# Altium schematic sheet Master Schematic.SchDoc
size A2; SheetNumber: 2; SheetTotal: 2
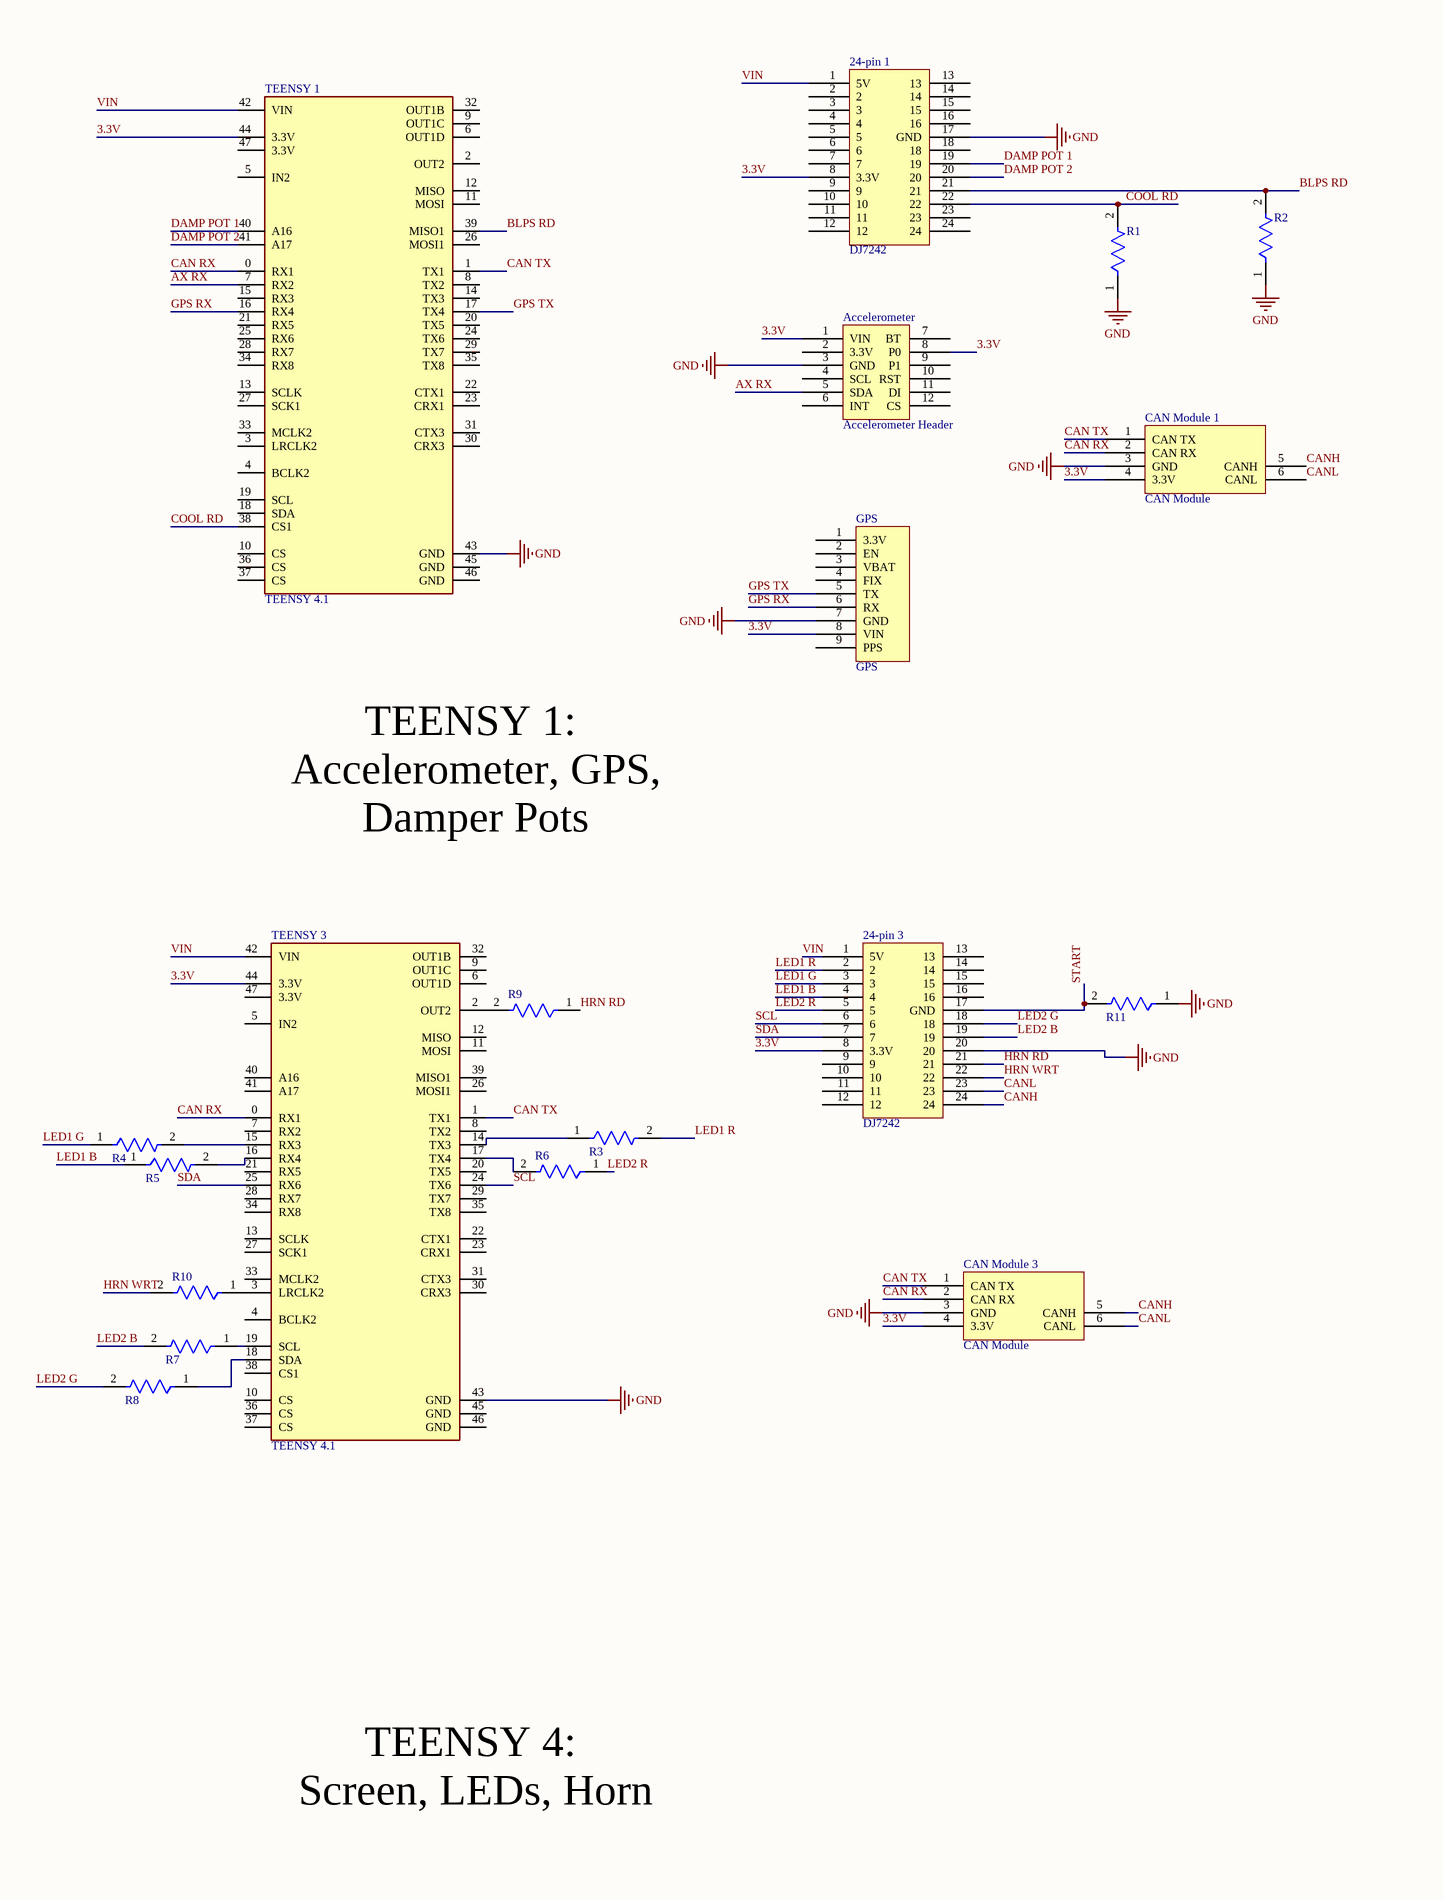
[diagram p0: Master Schematic.SchDoc, left]
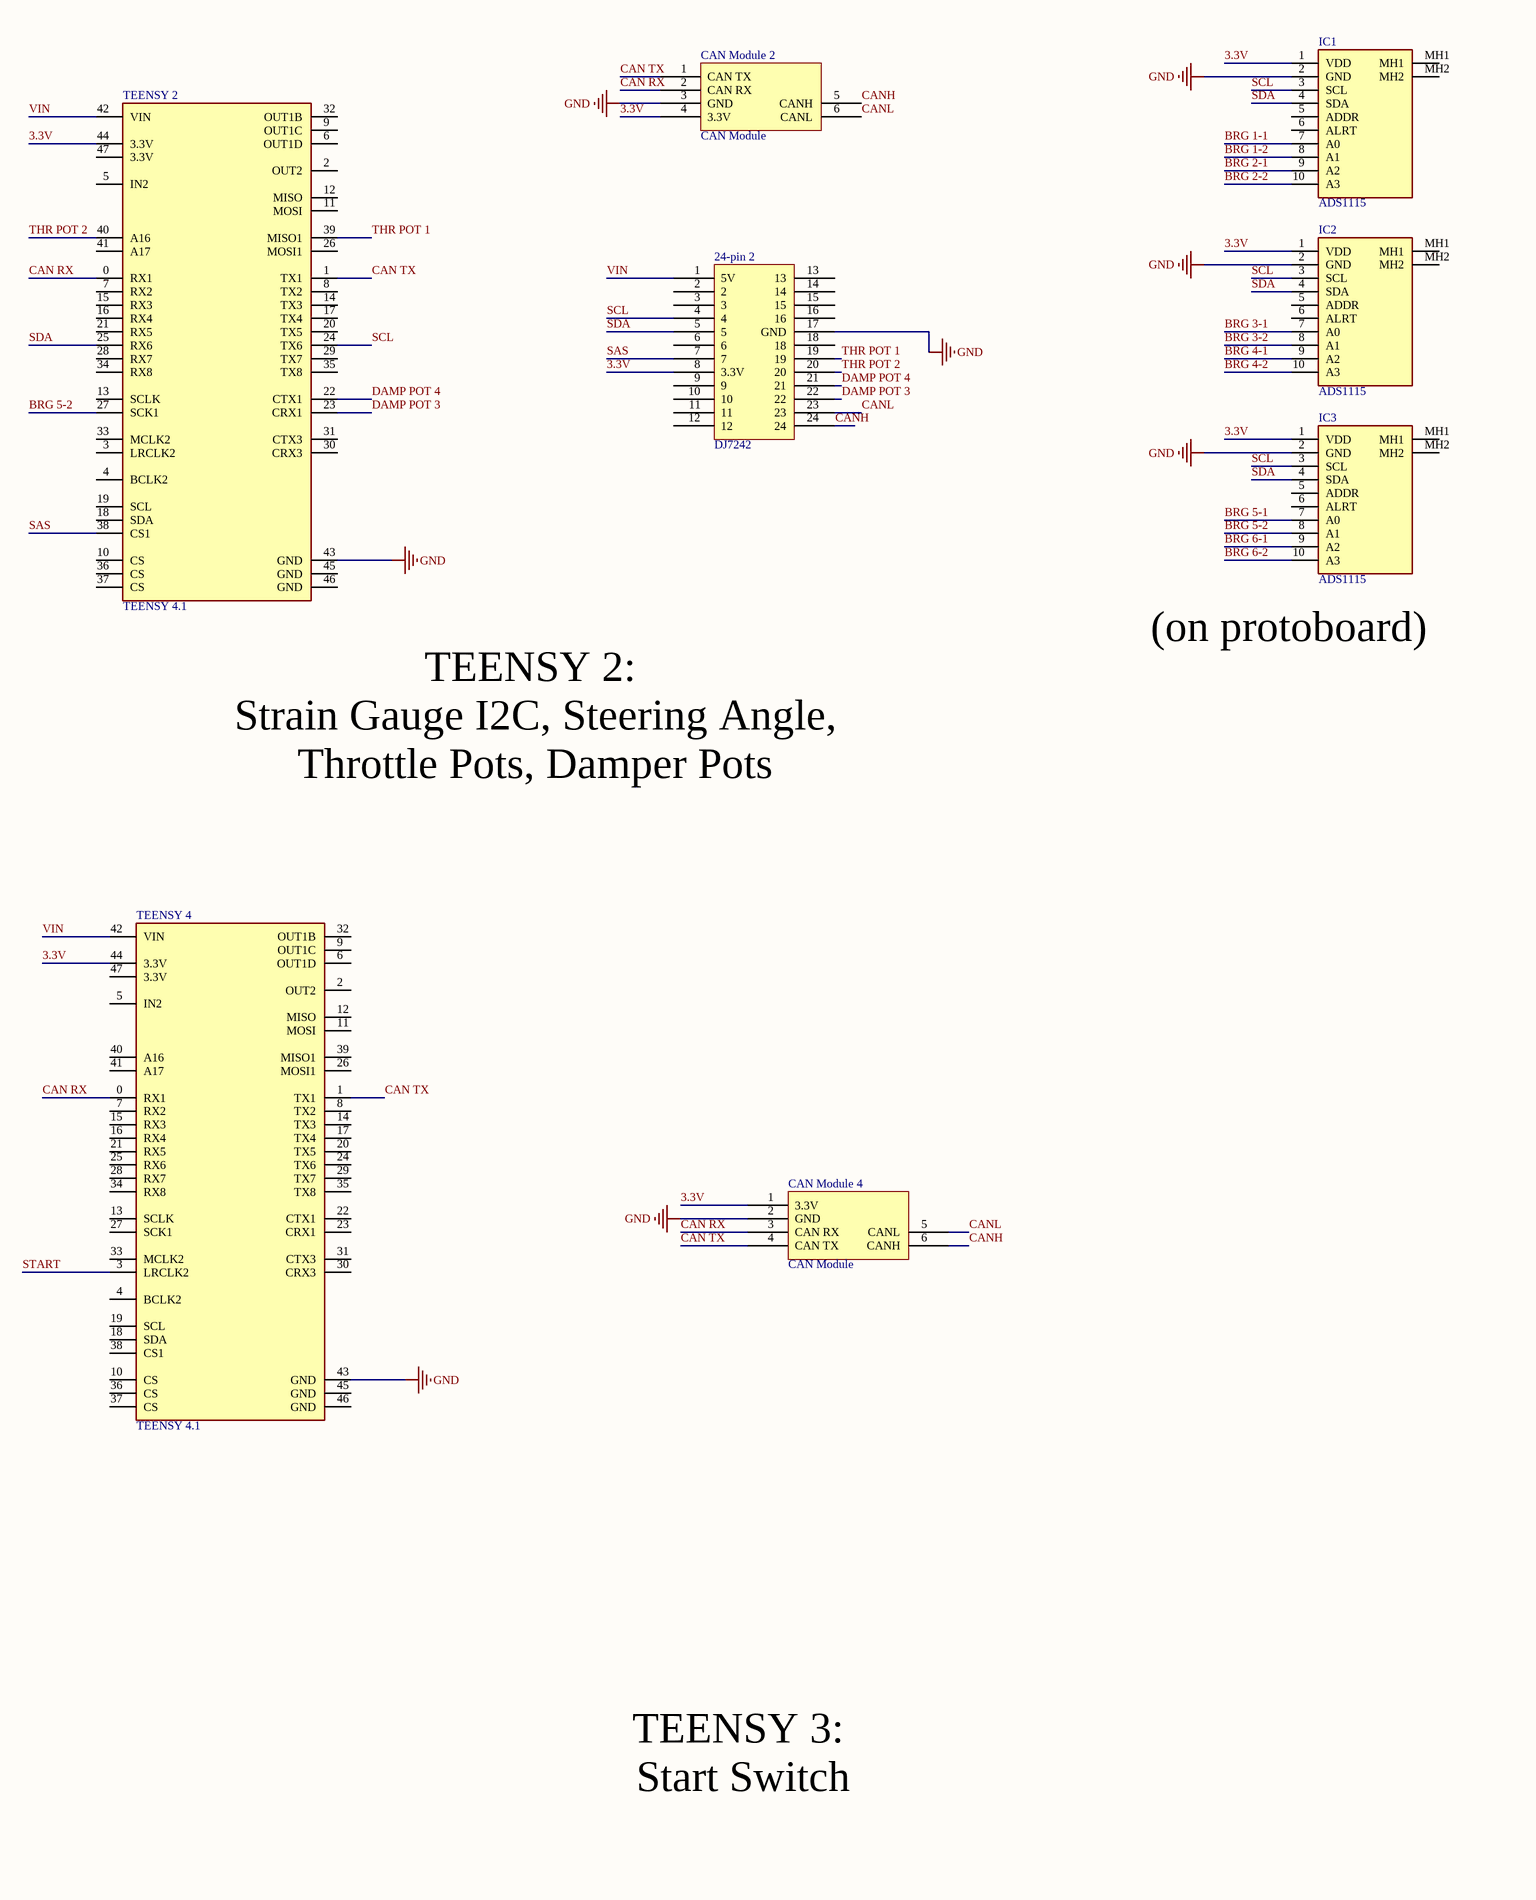
[diagram p1: Master Schematic.SchDoc, right]

## Parts
24-pin_1  DJ7242  [DJ7242-Footprint-1]
24-pin_2  DJ7242  [DJ7242-Footprint-1]
24-pin_3  DJ7242  [DJ7242-Footprint-1]
Accelerometer  Accelerometer Header  [Accelerometer Header-Footprint-1]
CAN_Module_1  CAN Module  [CAN Module-Footprint-1]
CAN_Module_2  CAN Module  [CAN Module-Footprint-1]
CAN_Module_3  CAN Module  [CAN Module-Footprint-1]
CAN_Module_4  CAN Module  [CAN Module-Footprint-1]
GPS  GPS  [GPS-Footprint-1]
IC1  ADS1115  [ADS1115]
IC2  ADS1115  [ADS1115]
IC3  ADS1115  [ADS1115]
R1  CMF5073K200FHEB  [FP-CMF50-0]  (value not drawn)
R2  CMF5073K200FHEB  [FP-CMF50-0]  (value not drawn)
R3  CMF5073K200FHEB  [FP-CMF50-0]  (value not drawn)
R4  CMF5073K200FHEB  [FP-CMF50-0]  (value not drawn)
R5  CMF5073K200FHEB  [FP-CMF50-0]  (value not drawn)
R6  CMF5073K200FHEB  [FP-CMF50-0]  (value not drawn)
R7  CMF5073K200FHEB  [FP-CMF50-0]  (value not drawn)
R8  CMF5073K200FHEB  [FP-CMF50-0]  (value not drawn)
R9  CMF5073K200FHEB  [FP-CMF50-0]  (value not drawn)
R10  CMF5073K200FHEB  [FP-CMF50-0]  (value not drawn)
R11  CMF5073K200FHEB  [FP-CMF50-0]  (value not drawn)
TEENSY_1  TEENSY 4.1  [FP-DEV-16996-MFG]
TEENSY_2  TEENSY 4.1  [FP-DEV-16996-MFG]
TEENSY_3  TEENSY 4.1  [FP-DEV-16996-MFG]
TEENSY_4  TEENSY 4.1  [FP-DEV-16996-MFG]

## Nets
GND: 24-pin_1.17(GND) 24-pin_2.17(GND) 24-pin_3.20 Accelerometer.3(GND) CAN_Module_1.3(GND) CAN_Module_2.3(GND) CAN_Module_3.3(GND) CAN_Module_4.2(GND) GPS.7(GND) IC1.2(GND) IC2.2(GND) IC3.2(GND) R1.1 R2.1 R11.1 TEENSY_1.43(GND) TEENSY_2.43(GND) TEENSY_3.43(GND) TEENSY_4.43(GND)
3.3V: 24-pin_1.8(3.3V) 24-pin_2.8(3.3V) 24-pin_3.8(3.3V) Accelerometer.1(VIN) Accelerometer.8(P0) CAN_Module_1.4(3.3V) CAN_Module_2.4(3.3V) CAN_Module_3.4(3.3V) CAN_Module_4.1(3.3V) GPS.8(VIN) IC1.1(VDD) IC2.1(VDD) IC3.1(VDD) TEENSY_1.44(3.3V) TEENSY_2.44(3.3V) TEENSY_3.44(3.3V) TEENSY_4.44(3.3V)
AX RX: Accelerometer.5(SDA) TEENSY_1.7(RX2)
BLPS RD: 24-pin_1.21 R2.2 TEENSY_1.39(MISO1)
BRG 1-1: IC1.7(A0)
BRG 1-2: IC1.8(A1)
BRG 2-1: IC1.9(A2)
BRG 2-2: IC1.10(A3)
BRG 3-1: IC2.7(A0)
BRG 3-2: IC2.8(A1)
BRG 4-1: IC2.9(A2)
BRG 4-2: IC2.10(A3)
BRG 5-1: IC3.7(A0)
BRG 5-2: IC3.8(A1) TEENSY_2.27(SCK1)
BRG 6-1: IC3.9(A2)
BRG 6-2: IC3.10(A3)
CAN RX: CAN_Module_1.2(CAN_RX) CAN_Module_2.2(CAN_RX) CAN_Module_3.2(CAN_RX) CAN_Module_4.3(CAN_RX) TEENSY_1.0(RX1) TEENSY_2.0(RX1) TEENSY_3.0(RX1) TEENSY_4.0(RX1)
CAN TX: CAN_Module_1.1(CAN_TX) CAN_Module_2.1(CAN_TX) CAN_Module_3.1(CAN_TX) CAN_Module_4.4(CAN_TX) TEENSY_1.1(TX1) TEENSY_2.1(TX1) TEENSY_3.1(TX1) TEENSY_4.1(TX1)
CANH: 24-pin_2.24 24-pin_3.24 CAN_Module_1.5(CANH) CAN_Module_2.5(CANH) CAN_Module_3.5(CANH) CAN_Module_4.6(CANH)
CANL: 24-pin_2.23 24-pin_3.23 CAN_Module_1.6(CANL) CAN_Module_2.6(CANL) CAN_Module_3.6(CANL) CAN_Module_4.5(CANL)
COOL RD: 24-pin_1.22 R1.2 TEENSY_1.38(CS1)
DAMP POT 1: 24-pin_1.19 TEENSY_1.40(A16)
DAMP POT 2: 24-pin_1.20 TEENSY_1.41(A17)
DAMP POT 3: 24-pin_2.22 TEENSY_2.23(CRX1)
DAMP POT 4: 24-pin_2.21 TEENSY_2.22(CTX1)
GPS RX: GPS.6(RX) TEENSY_1.16(RX4)
GPS TX: GPS.5(TX) TEENSY_1.17(TX4)
HRN RD: 24-pin_3.21 R9.1
HRN WRT: 24-pin_3.22 R10.2
LED1 B: 24-pin_3.4 R5.1
LED1 G: 24-pin_3.3 R4.1
LED1 R: 24-pin_3.2 R3.2
LED2 B: 24-pin_3.19 R7.2
LED2 G: 24-pin_3.18 R8.2
LED2 R: 24-pin_3.5 R6.1
SAS: 24-pin_2.7 TEENSY_2.38(CS1)
SCL: 24-pin_2.4 24-pin_3.6 IC1.3(SCL) IC2.3(SCL) IC3.3(SCL) TEENSY_2.24(TX6) TEENSY_3.24(TX6)
SDA: 24-pin_2.5 24-pin_3.7 IC1.4(SDA) IC2.4(SDA) IC3.4(SDA) TEENSY_2.25(RX6) TEENSY_3.25(RX6)
START: 24-pin_3.17(GND) R11.2 TEENSY_4.3(LRCLK2)
THR POT 1: 24-pin_2.19 TEENSY_2.39(MISO1)
THR POT 2: 24-pin_2.20 TEENSY_2.40(A16)
VIN: 24-pin_1.1(5V) 24-pin_2.1(5V) 24-pin_3.1(5V) TEENSY_1.42(VIN) TEENSY_2.42(VIN) TEENSY_3.42(VIN) TEENSY_4.42(VIN)
NetR3_1: R3.1 TEENSY_3.14(TX3)
NetR4_2: R4.2 TEENSY_3.15(RX3)
NetR5_2: R5.2 TEENSY_3.16(RX4)
NetR6_2: R6.2 TEENSY_3.17(TX4)
NetR7_1: R7.1 TEENSY_3.19(SCL)
NetR8_1: R8.1 TEENSY_3.18(SDA)
NetR9_2: R9.2 TEENSY_3.2(OUT2)
NetR10_1: R10.1 TEENSY_3.3(LRCLK2)

Not connected (* = marked no-connect by the designer): 24-pin_1 2 3 4 5 6 7 9 10 11 12 13 14 15 16 18 23 24; 24-pin_2 2 3 6 9 10 11 12 13 14 15 16 18; 24-pin_3 9 10 11 12 13 14 15 16; Accelerometer 2(3.3V) 4(SCL) 6(INT) 7(BT) 9(P1) 10(RST) 11(DI) 12(CS); GPS 1(3.3V) 2(EN) 3(VBAT) 4(FIX) 9(PPS); IC1 5(ADDR) 6(ALRT) MH1 MH2; IC2 5(ADDR) 6(ALRT) MH1 MH2; IC3 5(ADDR) 6(ALRT) MH1 MH2; TEENSY_1 2(OUT2) 3(LRCLK2) 4(BCLK2) 5(IN2) 6(OUT1D) 8(TX2) 9(OUT1C) 10(CS) 11(MOSI) 12(MISO) 13(SCLK) 14(TX3) 15(RX3) 18(SDA) 19(SCL) 20(TX5) 21(RX5) 22(CTX1) 23(CRX1) 24(TX6) 25(RX6) 26(MOSI1) 27(SCK1) 28(RX7) 29(TX7) 30(CRX3) 31(CTX3) 32(OUT1B) 33(MCLK2) 34(RX8) 35(TX8) 36(CS) 37(CS) 45(GND) 46(GND) 47(3.3V); TEENSY_2 2(OUT2) 3(LRCLK2) 4(BCLK2) 5(IN2) 6(OUT1D) 7(RX2) 8(TX2) 9(OUT1C) 10(CS) 11(MOSI) 12(MISO) 13(SCLK) 14(TX3) 15(RX3) 16(RX4) 17(TX4) 18(SDA) 19(SCL) 20(TX5) 21(RX5) 26(MOSI1) 28(RX7) 29(TX7) 30(CRX3) 31(CTX3) 32(OUT1B) 33(MCLK2) 34(RX8) 35(TX8) 36(CS) 37(CS) 41(A17) 45(GND) 46(GND) 47(3.3V); TEENSY_3 4(BCLK2) 5(IN2) 6(OUT1D) 7(RX2) 8(TX2) 9(OUT1C) 10(CS) 11(MOSI) 12(MISO) 13(SCLK) 20(TX5) 21(RX5) 22(CTX1) 23(CRX1) 26(MOSI1) 27(SCK1) 28(RX7) 29(TX7) 30(CRX3) 31(CTX3) 32(OUT1B) 33(MCLK2) 34(RX8) 35(TX8) 36(CS) 37(CS) 38(CS1) 39(MISO1) 40(A16) 41(A17) 45(GND) 46(GND) 47(3.3V); TEENSY_4 2(OUT2) 4(BCLK2) 5(IN2) 6(OUT1D) 7(RX2) 8(TX2) 9(OUT1C) 10(CS) 11(MOSI) 12(MISO) 13(SCLK) 14(TX3) 15(RX3) 16(RX4) 17(TX4) 18(SDA) 19(SCL) 20(TX5) 21(RX5) 22(CTX1) 23(CRX1) 24(TX6) 25(RX6) 26(MOSI1) 27(SCK1) 28(RX7) 29(TX7) 30(CRX3) 31(CTX3) 32(OUT1B) 33(MCLK2) 34(RX8) 35(TX8) 36(CS) 37(CS) 38(CS1) 39(MISO1) 40(A16) 41(A17) 45(GND) 46(GND) 47(3.3V)

## Notes on the sheet
- (near IC3) (on protoboard)
- TEENSY 1:
  Accelerometer, GPS, Damper Pots
- TEENSY 2:
  Strain Gauge I2C, Steering Angle,  Throttle Pots, Damper Pots
- TEENSY 4:
  Screen, LEDs, Horn
- TEENSY 3:
  Start Switch

## Library data of the parts
24-pin_1-24-pin_3 = CMP-00030-00002-5: 24-pin connector
Accelerometer = CMP-002-00071-3: Header for Adafruit Accelerometer
CAN_Module_1-CAN_Module_4 = CMP-00030-00003-1: CAN waveshare
GPS = CMP-002-00072-2: Adafruit GPS chip
IC1-IC3 = ADS1115: Integrated Circuit; Manufacturer_Name: Adafruit; Datasheet Link: https://cdn-learn.adafruit.com/downloads/pdf/adafruit-4-channel-adc-breakouts.pdf; Height: 3.25mm; Manufacturer_Part_Number: ADS1115
R1-R11 = CMP-00030-44386654-1: CMF5073K200FHEB Res Metal Film 73.2K Ohm 1% 0.125W(1/8W) ±50ppm/°C Epoxy AXL T/R; Max Power Dissipation: 250mW; Voltage Rating: 200V; Power Rating: 125mW; Resistance: 73.2kΩ; Tolerance: 1%; Width: 1.65mm; Length: 3.81mm; Schedule B: 8533210090, 8533210090; Termination: Axial; Lead Free: Lead Free; Diameter: 1.65mm; Voltage Rating (DC): 200V; NexarPartId: 44386654; Packaging: Cut Tape; Max Operating Temperature: 175°C; Composition: Metal Film; RoHS: Compliant; Mount: Through Hole; Features: Flame Retardant Coating, Moisture Resistant; Number of Terminations: 2; Temperature Coefficient: 50ppm/°C; Min Operating Temperature: -55°C; Case/Package: Axial
TEENSY_1-TEENSY_4 = CMP-157412-000001-1: TEENSY 4.1 (HEADERS)